# EAGLE design iPhoneSoftModem BreakOut_v1 (EAGLE 5.08)
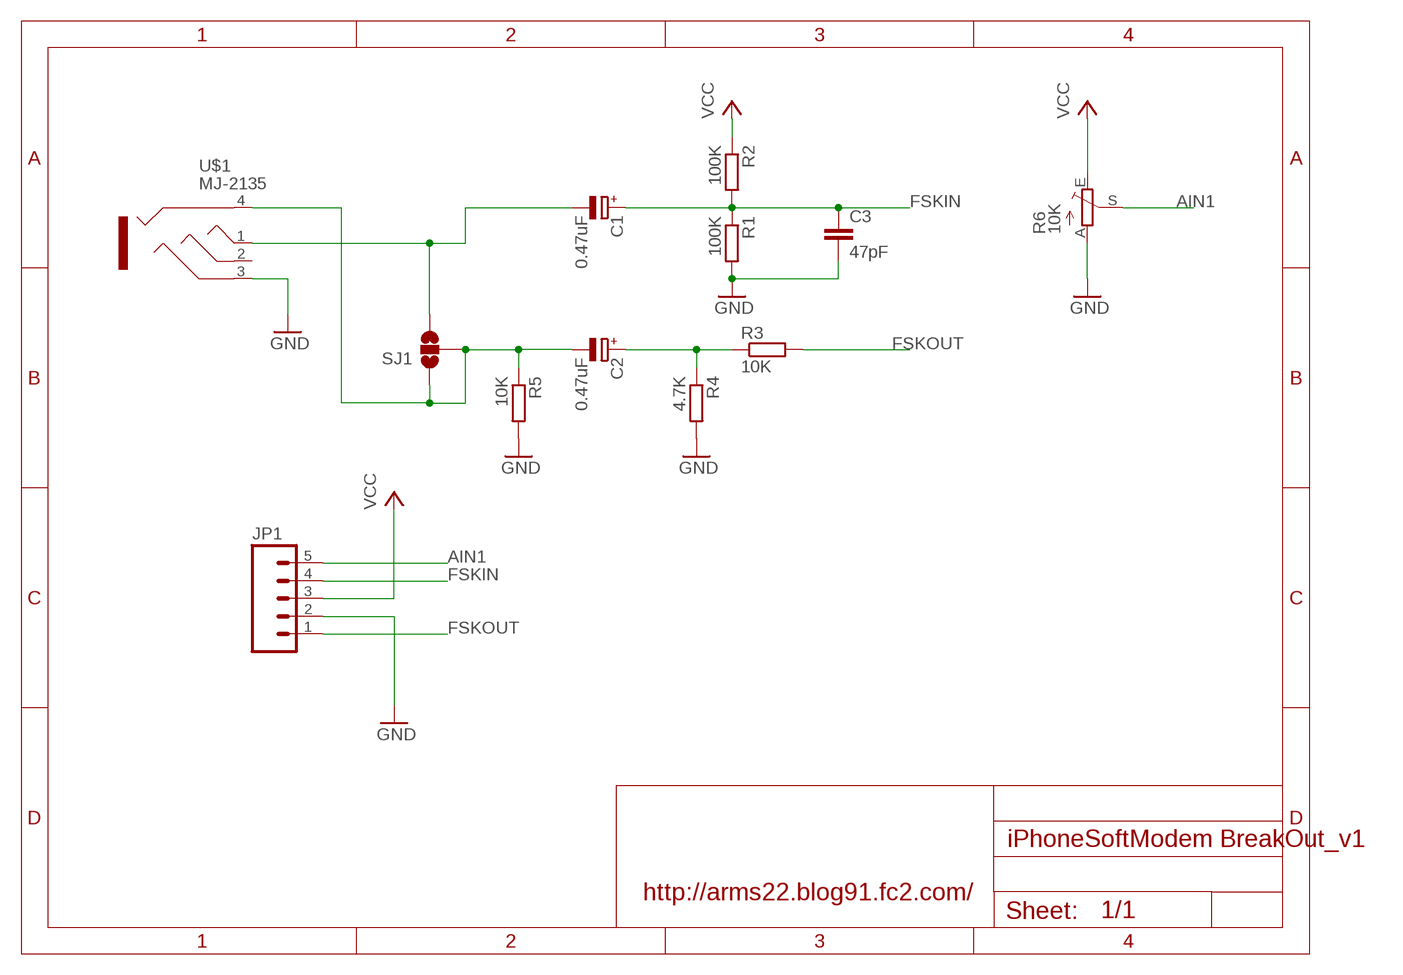
[diagram p0: schematic, sheet 1]

## Parts
C1  0.47uF  CPOL-EUE2.5-6  [E2,5-6]
C2  0.47uF  CPOL-EUE2.5-6  [E2,5-6]
C3  47pF  C-EU025-025X050  [C025-025X050]
JP1  M05PTH  [1X05]
R1  100K  R-EU_0204/5  [0204/5]
R2  100K  R-EU_0204/5  [0204/5]
R3  10K  R-EU_0204/5  [0204/5]
R4  4.7K  R-EU_0204/5  [0204/5]
R5  10K  R-EU_0204/5  [0204/5]
R6  10K  TRIM_EU-B25P  [B25P]
SJ1  SOLDERJUMPER_2WAYT  [SJ_2]
U$1  MJ-2135  [MJ-2135]

## Nets
AIN1: JP1.5 R6.S
FSKIN: C1.+ C3.1 JP1.4 R1.1 R2.2
FSKOUT: JP1.1 R3.2
GND: C3.2 JP1.2 R1.2 R4.2 R5.2 R6.A U$1.3
N$1: C2.- R5.1 SJ1.1 SJ1.2 U$1.4
N$2: C2.+ R3.1 R4.1
N$6: C1.- SJ1.3 U$1.1
VCC: JP1.3 R2.1 R6.E
Unconnected: U$1.2

## Notes on the sheet
- http://arms22.blog91.fc2.com/

## Library data of the parts
C1 C2 = rcl:CPOL-EU: POLARIZED CAPACITOR, European symbol
C3 = rcl:C-EU: CAPACITOR, European symbol
JP1 = iPhoneSoftModem:M05: Header 5 Standard 5-pin 0.1" header. Use with straight break away headers (SKU : PRT-00116), right angle break away headers (PRT-00553), swiss pins (PRT-00743), machine pins (PRT-00117), and female headers (PRT-00115). Molex polarized connector foot print use with SKU : PRT-08230 with associated crimp pins and housings.
R1-R5 = rcl:R-EU_: RESISTOR, European symbol
R6 = pot:TRIM_EU-: POTENTIOMETER
SJ1 = SparkFun:SOLDERJUMPER_2WAY: Solder Jumper 2 way solder jumper
U$1 = iPhoneSoftModem:MJ-2135

## Board
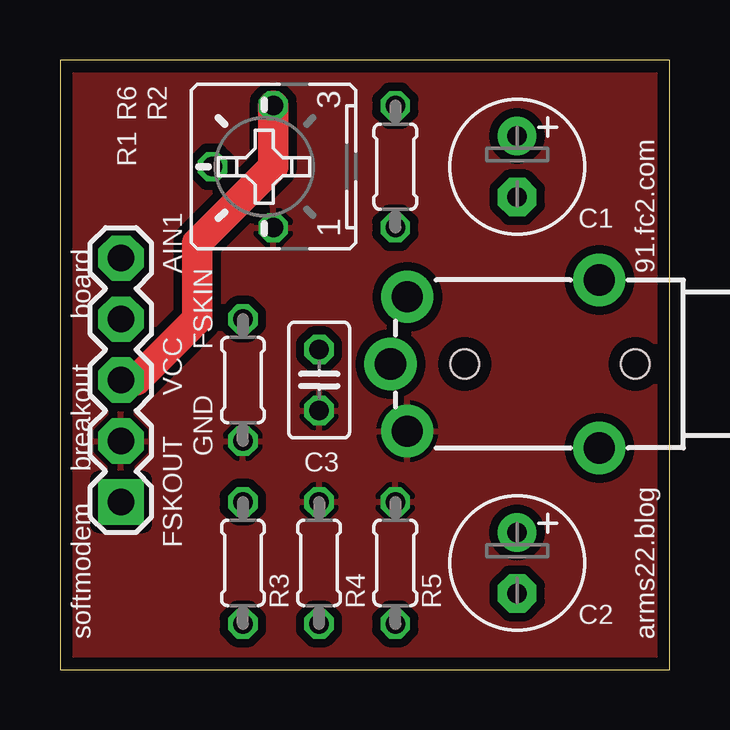
[diagram p1: board, top side]
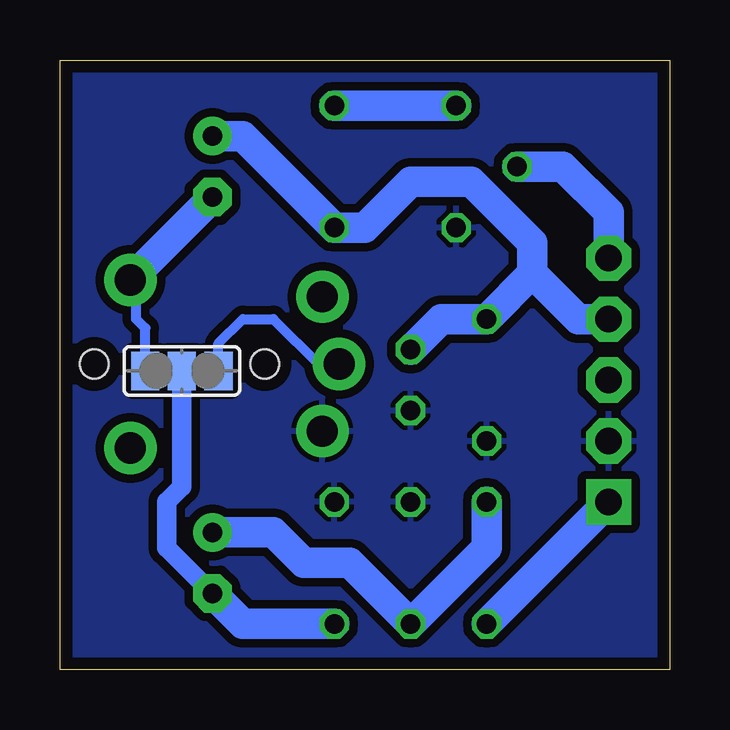
[diagram p2: board, bottom side, seen from below]

Size 25.4 x 25.4 mm. Coordinates in mm from the lower left corner, seen from the top.
Outline: 0,0 25.4,0 25.4,25.4 0,25.4 0,0
Copper layers (1*16): Top 0.035mm / dielectric 1.5mm / Bottom 0.035mm
Design rules "PCBCart-.3mmHoles-.1mmAnnulars": minimum track width 8mil, minimum drill 0.3mm, track to track 8mil, track to pad 8mil, pad to pad 8mil, via to via 8mil, smd to smd 8mil, copper to edge 20mil, drill to drill 8mil, minimum pad ring 8mil, minimum via ring 4mil, stop-mask expansion 3mil, vias tented up to drill 0mil, thermal gap 8mil

### Footprints (pad centres in the part's own frame; a part is rotated, then mirrored left to right if it is on the bottom)
E2,5-6 = drill 0.813 pad 1.6 round: + -1.27,0 | drill 0.813 pad 1.6 octagon: - 1.27,0
C025-025X050 = drill 0.813 octagon: 1 -1.27,0; 2 1.27,0
1X05 = drill 1.1 pad 1.88 square: 1 0,0 | drill 1.1 pad 1.88 octagon: 2 2.54,0; 3 5.08,0; 4 7.62,0; 5 10.16,0
0204/5 = drill 0.813 octagon: 1 -2.54,0; 2 2.54,0
B25P = drill 0.813 octagon: A -2.54,0; E 2.54,0; S 0,2.54
SJ_2 = smd 1.168 x 1.6: 1 -1.524,0; 2 0,0; 3 1.524,0
MJ-2135 = drill 1.3 pad 2.184 round: 1 0,8.5; 1@2 7,8.5; 2 0.7,0.5; 3 6.3,0.5; 4 3.5,-0.2 | hole 1.2: 3.5,2.9; 3.5,10

### Placement (x,y rotation side)
C1  19.05,20.95 270 top
C2  19.05,4.45 270 top
C3  10.79,12.06 270 top
JP1  2.54,6.99 90 top
R1  7.62,12.06 270 top
R2  13.97,20.95 270 top
R3  7.62,4.45 270 top
R4  10.79,4.45 90 top
R5  13.97,4.45 90 top
R6  8.89,20.95 90 top
SJ1  20.32,12.45 180 bottom
U$1  13.97,16.23 270 top

### Tracks (layer width: path | path; a pad name or v marks a point on that pad's centre or on a via)
AIN1
  Bottom 1.27: JP1.5 2.54,19.05 4.45,20.95 R6.S
FSKIN
  Bottom 1.27: C1.+ 17.78,22.23 R2.2 12.7,18.41 10.79,20.32 8.26,20.32 5.71,17.78 5.71,16.51 | 5.71,16.51 R1.1 9.53,14.61 C3.1 | JP1.4 3.81,14.61 5.71,16.51
FSKOUT
  Bottom 1.27: JP1.1 R3.2
GND
  pour Bottom (isolate 0.356): -1.27,26.67 -1.27,-1.27 28.57,-1.27 28.57,26.67
  pour Top (isolate 0.356): -0.64,26.04 27.94,26.04 27.94,-0.64 -0.64,-0.64
N$1
  Bottom 0.305: SJ1.2 SJ1.1
  Bottom 0.406: SJ1.1 18.8,13.59 17.78,14.61 16.51,14.61 14.61,12.7 13.8,12.7 U$1.4
  Bottom 0.813: C2.- 20.95,5.08 20.95,6.99 20.32,7.62 SJ1.2
  Bottom 1.27: R5.1 17.78,1.91 C2.-
N$2
  Bottom 1.27: R3.1 7.62,5.08 R4.1 13.34,4.45 15.24,4.45 16.51,5.71 C2.+
N$6
  Bottom 0.406: SJ1.3 21.84,14.22 22.23,14.61 22.23,15.99 U$1.1
  Bottom 1.27: C1.- 19.05,19.66 U$1.1
VCC
  Top 1.27: R6.E 8.89,20.95 5.71,17.78 5.71,14.61 3.17,12.06 JP1.3
  Bottom 1.27: R6.E R2.1

### Text on the board
tPlace: AIN1 | 91.fc2.com | board | FSKIN | VCC | GND | breakout | FSKOUT | softmodem | arms22.blog